# Altium schematic sheet analog_project_schematic_2.SchDoc
size A4; SheetNumber: 2; SheetTotal: 2
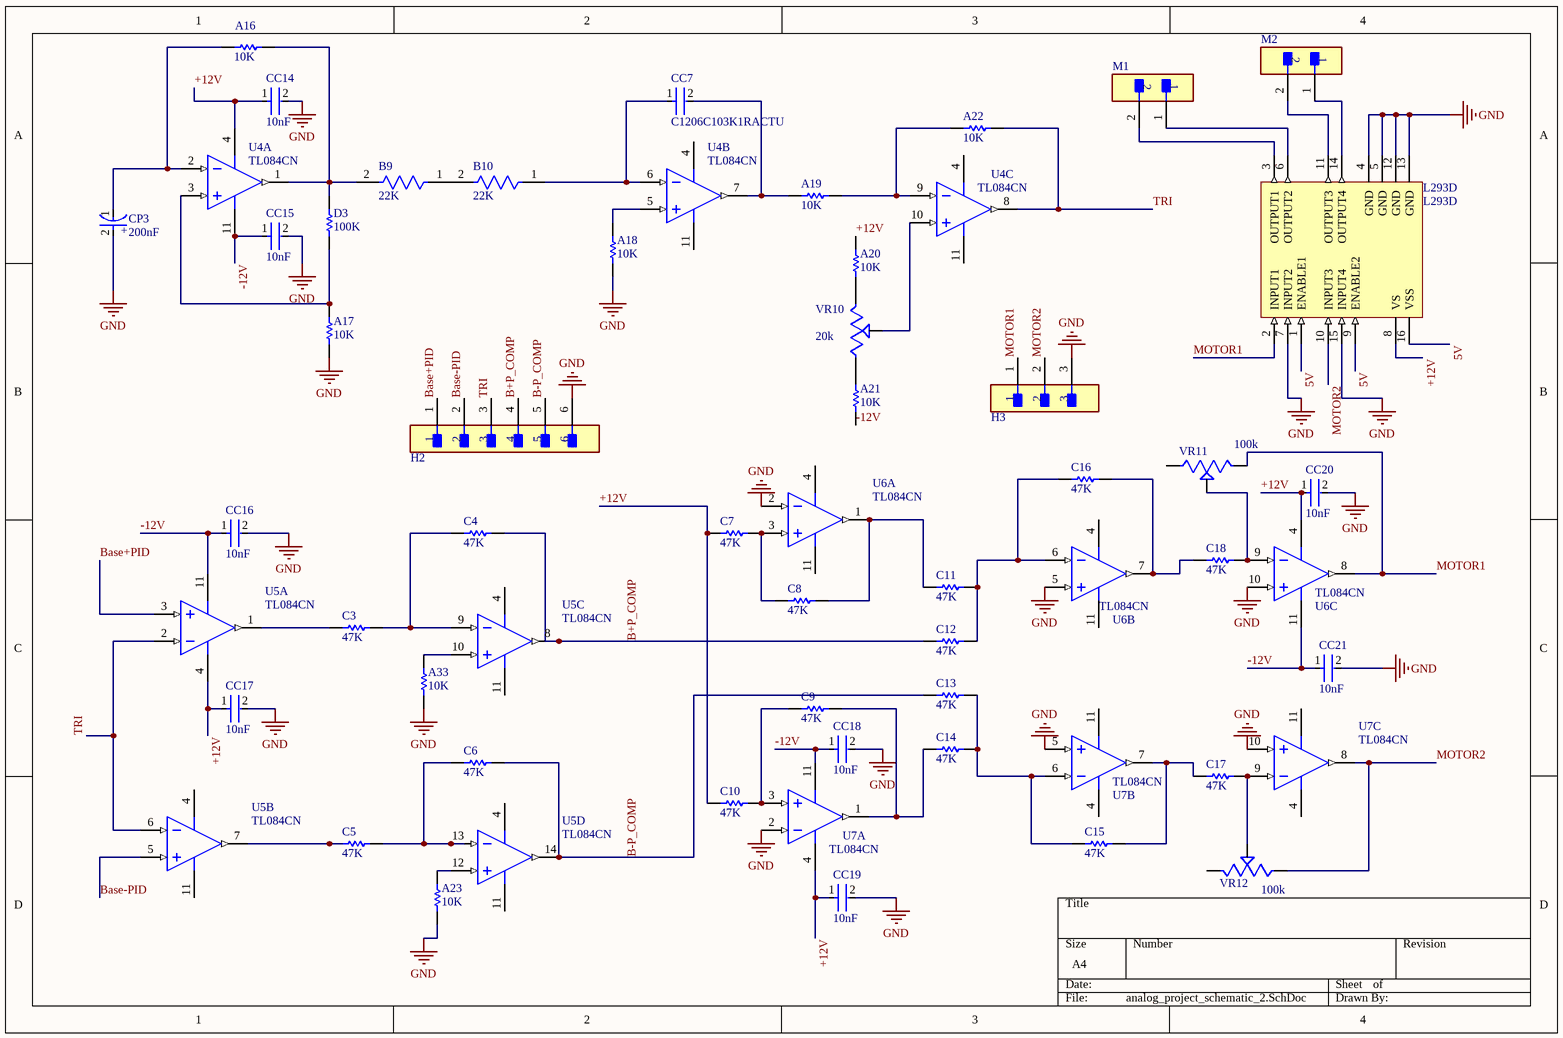
[diagram p0: analog_project_schematic_2.SchDoc]

## Parts
A16  10K  [RESC3216X70X50NL05T20]
A17  10K  [RESC3216X70X50NL05T20]
A18  10K  [RESC3216X70X50NL05T20]
A19  10K  [RESC3216X70X50NL05T20]
A20  10K  [RESC3216X70X50NL05T20]
A21  10K  [RESC3216X70X50NL05T20]
A22  10K  [RESC3216X70X50NL05T20]
A23  10K  [RESC3216X70X50NL05T20]
A33  10K  [RESC3216X70X50NL05T20]
B9  22K  [FP-CRCW1206-e3-IPC_A]
B10  22K  [FP-CRCW1206-e3-IPC_A]
C3  47K  [RESC3216X60X45LL10T20]
C4  47K  [RESC3216X60X45LL10T20]
C5  47K  [RESC3216X60X45LL10T20]
C6  47K  [RESC3216X60X45LL10T20]
C7  47K  [RESC3216X60X45LL10T20]
C8  47K  [RESC3216X60X45LL10T20]
C9  47K  [RESC3216X60X45LL10T20]
C10  47K  [RESC3216X60X45LL10T20]
C11  47K  [RESC3216X60X45LL10T20]
C12  47K  [RESC3216X60X45LL10T20]
C13  47K  [RESC3216X60X45LL10T20]
C14  47K  [RESC3216X60X45LL10T20]
C15  47K  [RESC3216X60X45LL10T20]
C16  47K  [RESC3216X60X45LL10T20]
C17  47K  [RESC3216X60X45LL10T20]
C18  47K  [RESC3216X60X45LL10T20]
CC7  C1206C103K1RACTU  [FP-C1206C-EB-MFG]
CC14  10nF  [FP-C1206C-EB-MFG]
CC15  10nF  [FP-C1206C-EB-MFG]
CC16  10nF  [FP-C1206C-EB-MFG]
CC17  10nF  [FP-C1206C-EB-MFG]
CC18  10nF  [FP-C1206C-EB-MFG]
CC19  10nF  [FP-C1206C-EB-MFG]
CC20  10nF  [FP-C1206C-EB-MFG]
CC21  10nF  [FP-C1206C-EB-MFG]
CP3  200nF  [FP-EEU-FR1H101B-MFG]
D3  100K  [RESC3216X60X45NL10T20]
H2  PEC06SBBN  [FP-PEC06SBBN-MFG]  (value not drawn)
H3  NRPN031PAEN-RC  [FP-NRPN031PAEN-RC-MFG]  (value not drawn)
L293D  L293D  [STM-L293D-16]
M1  B2B-XH-A(LF)(SN)  [FP-B2B-XH-A_LF_SN-MFG]  (value not drawn)
M2  B2B-XH-A(LF)(SN)  [FP-B2B-XH-A_LF_SN-MFG]  (value not drawn)
U4  TL084CN  [N0014A]  (parts A,B,C of 4)
U5  TL084CN  [N0014A]  (parts A,B,C,D of 4)
U6  TL084CN  [N0014A]  (parts A,B,C of 4)
U7  TL084CN  [N0014A]  (parts A,B,C of 4)
VR10  20k  [TRIM_3296Y-1-104]
VR11  100k  [TRIM_3296Y-1-104]
VR12  100k  [TRIM_3296Y-1-104]

## Nets
GND: A17.1 A18.1 A23.1 A33.1 CC14.2 CC15.2 CC16.2 CC17.2 CC18.2 CC19.2 CC20.2 CC21.2 CP3.2(A) H2.6 H3.3 L293D.4(GND) L293D.5(GND) L293D.7(INPUT2) L293D.12(GND) L293D.13(GND) L293D.15(INPUT4) U6.2(IN1-) U6.5(IN2+) U6.10(IN3+) U7.2(IN1-) U7.5(IN2+) U7.10(IN3+)
5V: L293D.1(ENABLE1) L293D.9(ENABLE2) L293D.16(VSS)
+12V: A20.2 C7.1 C10.1 CC14.1 CC17.1 CC19.1 CC20.1 L293D.8(VS) U4.4(VCC+) U5.4(VCC+) U6.4(VCC+) U7.4(VCC+)
-12V: A21.1 CC15.1 CC16.1 CC18.1 CC21.1 U4.11(VCC-) U5.11(VCC-) U6.11(VCC-) U7.11(VCC-)
B+P_COMP: C4.2 C12.1 H2.4 U5.8(OUT3)
B-P_COMP: C6.2 C13.1 H2.5 U5.14(OUT4)
Base+PID: H2.1 U5.3(IN1+)
Base-PID: H2.2 U5.5(IN2+)
MOTOR1: H3.1 L293D.2(INPUT1) U6.8(OUT3) VR11.1(CCW)
MOTOR2: H3.2 L293D.10(INPUT3) U7.8(OUT3) VR12.1(CCW)
TRI: A22.2 H2.3 U4.8(OUT3) U5.2(IN1-) U5.6(IN2-)
NetA16_1: A16.1 CP3.1(C) U4.2(IN1-)
NetA16_2: A16.2 B9.2 D3.2 U4.1(OUT1)
NetA17_2: A17.2 D3.1 U4.3(IN1+)
NetA18_2: A18.2 U4.5(IN2+)
NetA19_1: A19.1 CC7.2 U4.7(OUT2)
NetA19_2: A19.2 A22.1 U4.9(IN3-)
NetA20_1: A20.1 VR10.1(CCW)
NetA21_2: A21.2 VR10.3(CW)
NetA23_2: A23.2 U5.12(IN4+)
NetA33_2: A33.2 U5.10(IN3+)
NetB9_1: B9.1 B10.2
NetB10_1: B10.1 CC7.1 U4.6(IN2-)
NetC3_1: C3.1 U5.1(OUT1)
NetC3_2: C3.2 C4.1 U5.9(IN3-)
NetC5_1: C5.1 U5.7(OUT2)
NetC5_2: C5.2 C6.1 U5.13(IN4-)
NetC7_2: C7.2 C8.1 U6.3(IN1+)
NetC8_2: C8.2 C11.1 U6.1(OUT1)
NetC9_1: C9.1 C10.2 U7.3(IN1+)
NetC9_2: C9.2 C14.1 U7.1(OUT1)
NetC11_2: C11.2 C12.2 C16.1 U6.6(IN2-)
NetC13_2: C13.2 C14.2 C15.1 U7.6(IN2-)
NetC15_2: C15.2 C17.1 U7.7(OUT2)
NetC16_2: C16.2 C18.1 U6.7(OUT2)
NetC17_2: C17.2 U7.9(IN3-) VR12.2(WIPER)
NetC18_2: C18.2 U6.9(IN3-) VR11.2(WIPER)
NetL293D_3: L293D.3(OUTPUT1) M1.2
NetL293D_6: L293D.6(OUTPUT2) M1.1
NetL293D_11: L293D.11(OUTPUT3) M2.2
NetL293D_14: L293D.14(OUTPUT4) M2.1
NetU4_10: U4.10(IN3+) VR10.2(WIPER)

Not connected (* = marked no-connect by the designer): VR11 3(CW); VR12 3(CW)

## Notes on the sheet
- (in symbol CMP-05427-000020-1) +

## Library data of the parts
A16-A23 A33 = CMP-2003-00545-1: Part Number: ERJ-8GEYJ103V; Manufacturer: Panasonic
B9 B10 = CMP-2003-01962-2: RES Thick Film, 22kΩ, 1%, 0.25W, 100ppm/°C, 1206; Voltage Rating (DC): 200V; Resistance: 22kR; Max Power Dissipation: 250mW; Lead Free: Lead Free; Length: 3.2mm; Case Code (Imperial): 1206; Max Operating Temperature: 155°C; Packaging: Tape and Reel; Composition: Thick Film; Temperature Coefficient: 100ppm/°C; Contact Plating: Tin; Number of Terminations: 2; Case Code (Metric): 3216; Tolerance: 1%; Weight: 0.000353oz; Features: Automotive AEC-Q200; Min Operating Temperature: -55°C; Width: 0.063inch; Package Quantity: 10; Case/Package: 1206; Termination: SMD/SMT; Military Standard: Not; Depth: 1.6mm; Voltage Rating: 200V; Radiation Hardening: No; Power Rating: 250mW; Height: 0.55mm
C3-C18 = CMP-2003-02213-1: Part Number: CRCW120647K0FKEA; Manufacturer: Vishay Dale
CC7 = CMP-03020-021723-1: Cap Ceramic 0.01uF 100V X7R 10% SMD 1206 125°C Plastic T/R; Manufacturer: KEMET; Temperature Coefficient: 15%; Tolerance: 0.1; Capacitance: 10,000 pF; Value: 10,000 pF; Automotive Grade: Grade 0; Device Class L3: Ceramic Capacitors; Ipc Land Pattern Name: CAPC320160X78; Temperature Characteristic: X7R; Material: Ceramic; Category: Cap; Device Class L2: Capacitors; RoHS: TRUE; Manufacturer Part Number: C1206C103K1RACTU; Mouser Description: Multilayer Ceramic Capacitors MLCC - SMD/SMT 100volts 10000pF X7R 10%; Octopart: https://octopart.com/c1206c103k1ractu-kemet-117927; Temperature: -55°C to +150°C; Temperature Range Low: -55°C; Lead Free: Yes; Automotive: Yes; ComponentLink2URL: https://content.kemet.com/datasheets/KEM_C1007_X8R_ULTRA_150C_SMD.pdf; Package: C1206C-EB; Voltage Rating: 100 V; Temperature Range High: +150°C; ComponentLink2Description: Datasheet; Height: 0.88mm; Device Class L1: Passive Components; Digikey Description: Cap Ceramic 0.01uF 100V X7R 10% SMD 1206 125°C Plastic T/R
CC14-CC21 = CMP-03020-021723-1: Cap Ceramic 0.01uF 100V X7R 10% SMD 1206 125°C Plastic T/R; Manufacturer: KEMET; Manufacturer Part Number: C1206C103K1RACTU; Temperature Coefficient: 15%; Tolerance: 0.1; Capacitance: 10,000 pF; Value: 10,000 pF; Automotive Grade: Grade 0; Device Class L3: Ceramic Capacitors; Ipc Land Pattern Name: CAPC320160X78; Temperature Characteristic: X7R; Material: Ceramic; Category: Cap; Device Class L2: Capacitors; RoHS: TRUE; Mouser Description: Multilayer Ceramic Capacitors MLCC - SMD/SMT 100volts 10000pF X7R 10%; Octopart: https://octopart.com/c1206c103k1ractu-kemet-117927; Temperature: -55°C to +150°C; Temperature Range Low: -55°C; Lead Free: Yes; Automotive: Yes; ComponentLink2URL: https://content.kemet.com/datasheets/KEM_C1007_X8R_ULTRA_150C_SMD.pdf; Package: C1206C-EB; Voltage Rating: 100 V; Temperature Range High: +150°C; ComponentLink2Description: Datasheet; Height: 0.88mm; Device Class L1: Passive Components; Digikey Description: Cap Ceramic 0.01uF 100V X7R 10% SMD 1206 125°C Plastic T/R
CP3 = CMP-05427-000020-1: CAP ALUM 100UF 20% 50V RADIAL; Life (Hours): 6000Hour; Ripple Current: 870mA; Lead Diameter: 0.6mm; Impedance: 61mR; Tolerance: 20%; Mount: Through Hole; Lead Free: Lead Free; Length: 11.5mm; Height - Seated (Max): 0.512inch; Contact Plating: Tin; Termination: Radial; Series: FR; Max Operating Temperature: 105°C; Features: General Purpose; Min Operating Temperature: -40°C; RoHS Compliant: Yes; Height: 11.5mm; Voltage Rating (DC): 50V; Diameter: 8mm; Capacitance: 100uF; Lead Pitch: 5mm; Radiation Hardening: No; Package Quantity: 1; Case/Package: Radial; Voltage Rating: 50V; Packaging: Tape and Reel; ESR (Equivalent Series Resistance): 61mR; REACH SVHC: No SVHC
D3 = CMP-1014-00736-2: Part Number: CRCW1206100KFKEA; Manufacturer: Vishay Dale
H2 = CMP-25680-000045-1: CONN HEADER R/A 6POS 2.54MM; Number of Contacts: 6; Gender: Male; Pitch: 0.1inch; Connector Type: Male Pin; Termination: Solder; Mount: Through Hole; Contact Material: Bronze; RoHS Compliant: Yes; Height: 3.56mm; Number of Rows: 1; Housing Color: Black; Width: 2.54mm; Contact Type: Male Pin; Contact Plating: Tin; Number of Positions: 6; Package Quantity: 1; Length: 15.2mm; Contact Mating Length: 0.23inch; Packaging: Bulk; Lead Free: Lead Free; Housing Material: Plastic; Color: Black
H3 = CMP-25680-000021-1: CONN HEADER VERT 3POS 2MM; Manufacturer: Sullins; Description: Connector Header Through Hole 3 position 0.079" (2.00mm); Number Of Contacts: 3; Conn Orientation: Straight; Voltage Rating: 150V; Conn Gender: Male; Current Rating: 2A; Temperature Range High: +105°C; Category: Conn; Manufacturer Part Number: NRPN031PAEN-RC; RoHS: TRUE; Contact Material: Gold,Nickel; ComponentLink2URL: https://drawings-pdf.s3.amazonaws.com/10531.pdf; Temperature: -40°C to +105°C; Lead Free: Yes; Octopart: https://octopart.com/nrpn031paen-rc-sullins-12817732; ComponentLink2Description: Datasheet; Pitch: 2mm; Number Of Rows: 1; Automotive: No; Height: 6mm; Device Class L2: Headers and Wire Housings; Digikey Description: CONN HEADER VERT 3POS 2MM; Package: 0; Device Class L3: unset; Temperature Range Low: -40°C; Device Class L1: Connectors
L293D = CMP-2000-06524-1: Push-Pull Four Channel Driver with Diode, 4.5 to 36 V, -40 to 150 degC, 16-Pin PDIP, RoHS, Tube; Manufacturer: STMicroelectronics; Number of Outputs: 4; Current - Peak Output: 1.2A; Current - Output / Channel: 600mA; Input Type: Non-Inverting; Other Related Documents: L293DViewAllSpecifications; Type: HalfBridge; Voltage - Supply: 4.5V~36V; Other Names: 497-2936-5; Package / Case: 16-DIP(0.300",7.62mm); PartNumber: L293D; Operating Temperature: -40°C~150°C; Datasheet URL: http://www.st.com/st-web-ui/static/active/en/resource/technical/document/datasheet/CD00000059.pdf; Supplier Device Package: 16-PowerDIP; Packaging: Tube; Package Description: 16-Pin Thru-Hole Dual-In-Line, Body 20 x 6.85 mm, Pitch 2.54 mm; Standard Package: 25; Datasheet Version: 07/2003; On-State Resistance: -; Manufacturer URL: http://www.st.com/; Category: IntegratedCircuits(ICs); Family: PMIC-MOSFET,BridgeDrivers-InternalSwitch; Series: -; Dynamic Catalog: HalfBridge; Mounting Technology: ThroughHole; Package Reference: DIP-16; Mounting Type: ThroughHole
M1 M2 = CMP-2000-05888-3: CONN HEADER VERT 2POS 2.5MM; Current Rating: 3A; Voltage Rating: 250V; Number of Contacts: 2; Contact Resistance: 20mR; Wire/Cable Gauge: 22AWG; Insulation Resistance: 1GR; Connector Type: Male Pin; Packaging: Bulk; Contact Material: Brass; Lead Free: Lead Free; Orientation: Straight; Contact Plating: Tin; Max Current Rating: 3A; Termination: Solder; Fastening Type: Detent; Depth: 5.75mm; Housing Material: Polyamide; REACH SVHC: No SVHC; Series: XH; Voltage Rating (AC): 250V; Number of Positions: 2; Color: Natural; Contact Type: Male Pin; Max Voltage Rating (DC): 250V; Pitch: 2.5mm; Lead Pitch: 2.5mm; Mount: Through Hole; Max Operating Temperature: 85°C; Length: 7.4mm; Max Voltage Rating (AC): 250V; Min Operating Temperature: -25°C; Number of Rows: 1; Housing Color: White
U4-U7 = CMP-0017-00818-2: JFET-Input Operational Amplifier, 7 to 36 V, 0 to 70 degC, 14-pin DIP (N14), Pb-Free (RoHS); Manufacturer: Texas Instruments; Rating: Catalog; Iq per channel(Max)(mA): 2.8; Number of Channels: 4; IIB(Max)(pA): 400; Vio (25C)(Max)(mV): 15; GBW(Typ)(MHz): 3; Total Supply Voltage(Max)(+5V is 5, +/-5V is 10): 36; Vn at 1kHz(Typ)(nV/rtHz): 18; Sub Family: General Purpose Amplifier, High Supply Voltage Amplifier (>=30V); Slew Rate(Typ)(V/us): 13; Total Supply Voltage(Min)(+5V is 5, +/-5V is 10): 7; CMRR(Min)(dB): 70; ComponentLink3Description: Package Specification; PackageDescription: 14-Pin Plastic In-Line, Body 19.305 x 6.35 mm, Pitch 2.54 mm; ComponentLink1Description: Manufacturer URL; PackageVersion: 4040049/E, 12/2002; Eco-Plan: Pb-Free (RoHS); ComponentLink2URL: http://www.ti.com/lit/ds/symlink/tl084.pdf; ComponentLink1URL: http://www.ti.com/; DatasheetVersion: SLOS081G; Mounting Technology: Through Hole; PartNumber: TL084CN; Offset Drift(Typ)(uV/C): 18; PackageReference: N0014A; ComponentLink3URL: http://www.ti.com/lit/ml/mpdi002c/mpdi002c.pdf; ComponentLink2Description: Datasheet; Code_JEDEC: MS-001
VR10-VR12 = 3296Y-1-104: Price: None; MP: 3296Y-1-104; Availability: Unavailable; Package: None; Value: *